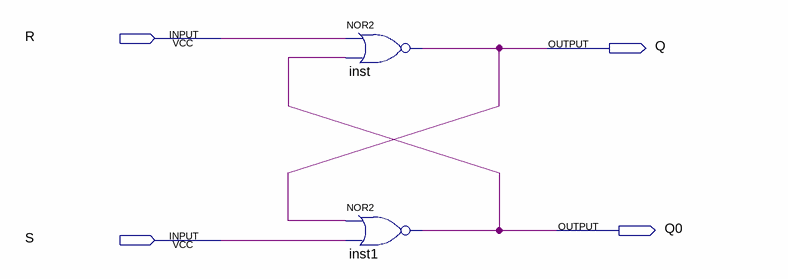
[diagram p0: schematic sheet]
// Quartus schematic SRLatch.bdf as structural Verilog: 2 symbols, 4 pins
module SRLatch (
  input  R,
  input  S,
  output Q,
  output Q0
);

  nor inst (Q, R, Q0);
  nor inst1 (Q0, Q, S);
endmodule
